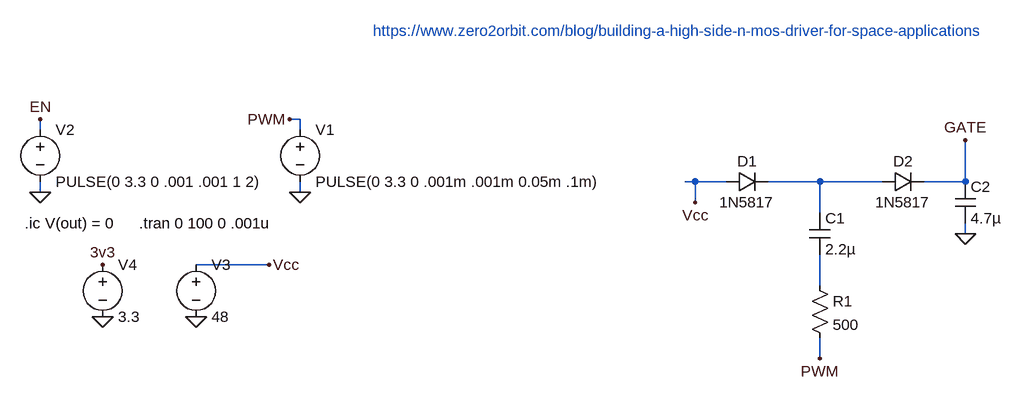
[diagram p0: schematic stm_nmos.asc]
stm_nmos.asc, the LTspice schematic file:
Version 4.1
SHEET 1 2620 680
WIRE -432 -336 -448 -336
WIRE -832 -320 -832 -336
WIRE -432 -320 -432 -336
WIRE 176 -240 160 -240
WIRE 224 -240 176 -240
WIRE 368 -240 288 -240
WIRE 464 -240 368 -240
WIRE 592 -240 592 -304
WIRE 592 -240 528 -240
WIRE -832 -224 -832 -240
WIRE -432 -224 -432 -240
WIRE 176 -208 176 -240
WIRE 368 -192 368 -240
WIRE 592 -160 592 -176
WIRE -480 -112 -592 -112
WIRE 368 -80 368 -128
WIRE 368 32 368 0
FLAG -432 -224 0
FLAG -448 -336 PWM
FLAG 368 32 PWM
FLAG -832 -224 0
FLAG -832 -336 EN
FLAG 592 -160 0
FLAG 592 -304 GATE
FLAG -480 -112 Vcc
FLAG -592 -32 0
FLAG -736 -112 3v3
FLAG -736 -32 0
FLAG 176 -208 Vcc
SYMBOL voltage -432 -336 R0
WINDOW 123 0 0 Left 0
WINDOW 39 0 0 Left 0
SYMATTR InstName V1
SYMATTR Value PULSE(0 3.3 0 .001m .001m 0.05m .1m)
SYMBOL diode 224 -224 R270
WINDOW 0 32 32 VTop 2
WINDOW 3 0 32 VBottom 2
SYMATTR InstName D1
SYMATTR Value 1N5817
SYMBOL diode 464 -224 R270
WINDOW 0 32 32 VTop 2
WINDOW 3 0 32 VBottom 2
SYMATTR InstName D2
SYMATTR Value 1N5817
SYMBOL cap 352 -192 R0
SYMATTR InstName C1
SYMATTR Value 2.2µ
SYMBOL res 352 -96 R0
SYMATTR InstName R1
SYMATTR Value 500
SYMBOL voltage -832 -336 R0
WINDOW 123 0 0 Left 0
WINDOW 39 0 0 Left 0
SYMATTR InstName V2
SYMATTR Value PULSE(0 3.3 0 .001 .001 1 2)
SYMBOL cap 576 -240 R0
SYMATTR InstName C2
SYMATTR Value 4.7µ
SYMBOL voltage -592 -128 R0
WINDOW 123 0 0 Left 0
WINDOW 39 0 0 Left 0
SYMATTR InstName V3
SYMATTR Value 48
SYMBOL voltage -736 -128 R0
WINDOW 123 0 0 Left 0
WINDOW 39 0 0 Left 0
SYMATTR InstName V4
SYMATTR Value 3.3
TEXT -680 -176 Left 2 !.tran 0 100 0 .001u
TEXT -856 -176 Left 2 !.ic V(out) = 0
TEXT -320 -472 Left 2 ;https://www.zero2orbit.com/blog/building-a-high-side-n-mos-driver-for-space-applications

The netlist it stands for:
* stm_nmos.asc
V1 PWM 0 PULSE(0 3.3 0 .001m .001m 0.05m .1m)
D1 Vcc N001 1N5817
D2 N001 GATE 1N5817
C1 N001 N002 2.2µ
R1 N002 PWM 500
V2 EN 0 PULSE(0 3.3 0 .001 .001 1 2)
C2 GATE 0 4.7µ
V3 Vcc 0 48
V4 3v3 0 3.3
.model D D
.lib standard.dio
.tran 0 100 0 .001u
.ic V(out) = 0
* https://www.zero2orbit.com/blog/building-a-high-side-n-mos-driver-for-space-applications
.backanno
.end